# EAGLE design 100pqfpBreakout (EAGLE 6.6.0)
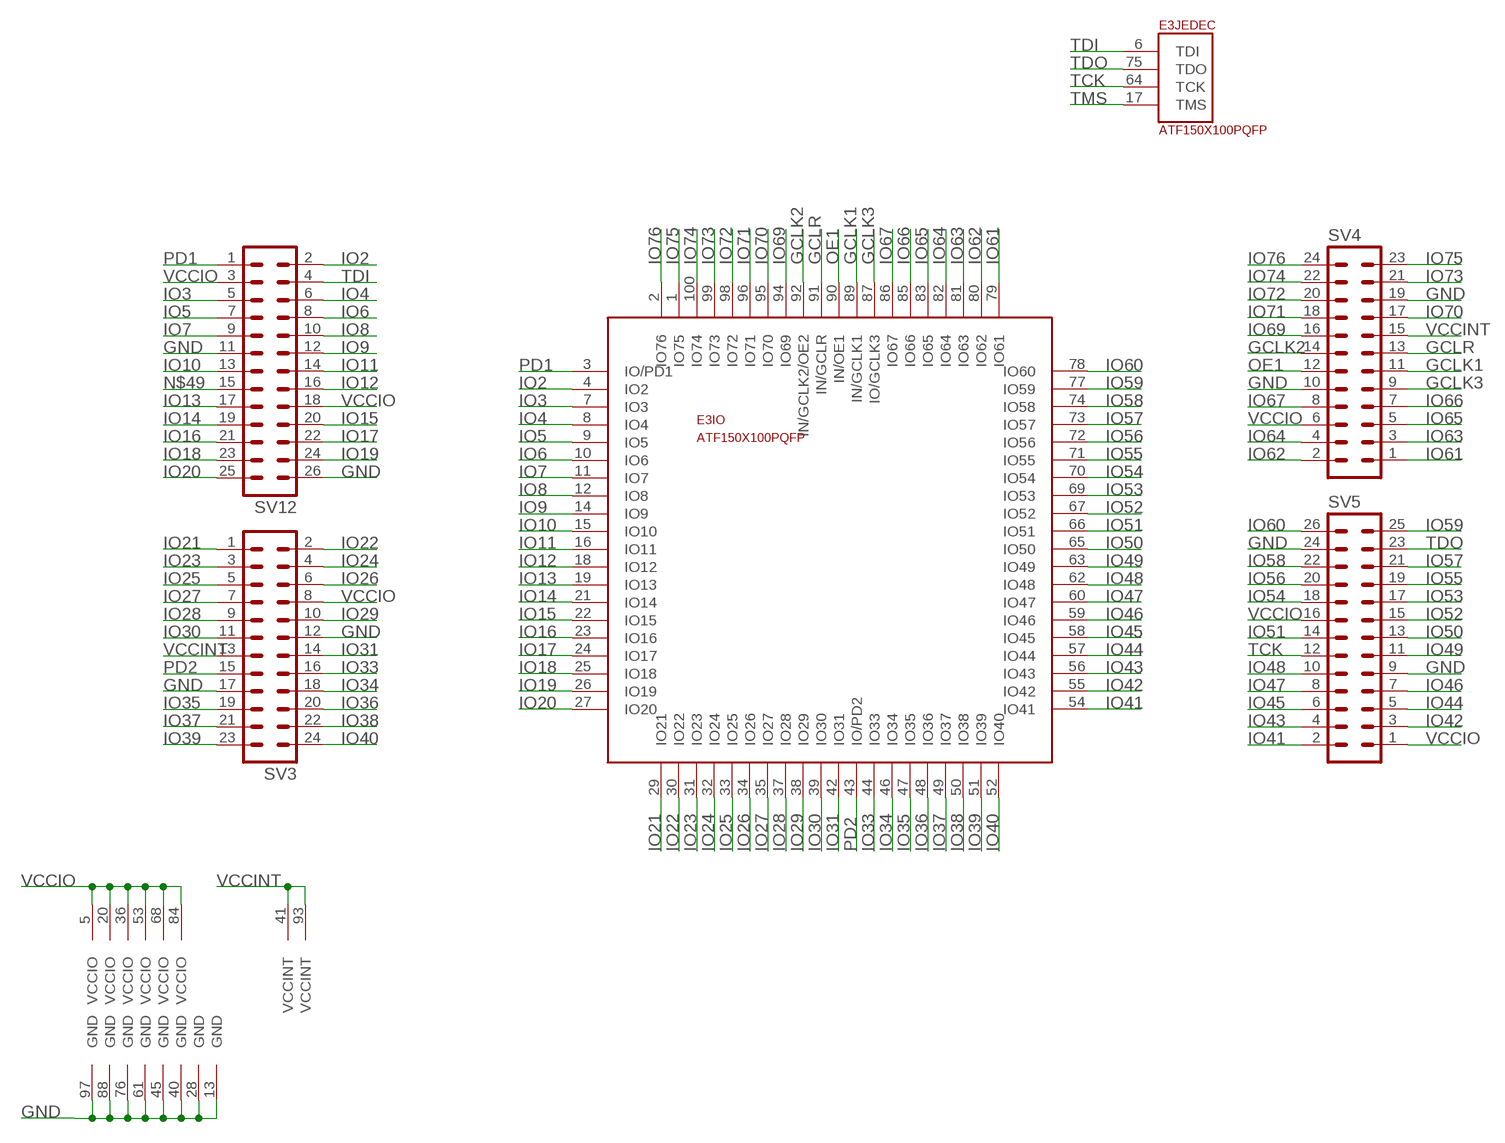
[diagram p0: schematic, sheet 1]

## Parts
E3  ATF150X100PQFP  [PQFP-100]
SV3  MA12-2  [MA12-2]
SV4  MA12-2  [MA12-2]
SV5  MA13-2  [MA13-2]
SV12  MA13-2  [MA13-2]

## Nets
GCLK1: E3.89(IO:IN/GCLK1) SV4.11
GCLK2: E3.92(IO:IN/GCLK2/OE2) SV4.14
GCLK3: E3.87(IO:IO/GCLK3) SV4.9
GCLR: E3.91(IO:IN/GCLR) SV4.13
GND: E3.13(GND) E3.28(GND) E3.40(GND) E3.45(GND) E3.61(GND) E3.76(GND) E3.88(GND) E3.97(GND) SV3.12 SV3.17 SV4.10 SV4.19 SV5.9 SV5.24 SV12.11 SV12.26
IO2: E3.4(IO:IO2) SV12.2
IO3: E3.7(IO:IO3) SV12.5
IO4: E3.8(IO:IO4) SV12.6
IO5: E3.9(IO:IO5) SV12.7
IO6: E3.10(IO:IO6) SV12.8
IO7: E3.11(IO:IO7) SV12.9
IO8: E3.12(IO:IO8) SV12.10
IO9: E3.14(IO:IO9) SV12.12
IO10: E3.15(IO:IO10) SV12.13
IO11: E3.16(IO:IO11) SV12.14
IO12: E3.18(IO:IO12) SV12.16
IO13: E3.19(IO:IO13) SV12.17
IO14: E3.21(IO:IO14) SV12.19
IO15: E3.22(IO:IO15) SV12.20
IO16: E3.23(IO:IO16) SV12.21
IO17: E3.24(IO:IO17) SV12.22
IO18: E3.25(IO:IO18) SV12.23
IO19: E3.26(IO:IO19) SV12.24
IO20: E3.27(IO:IO20) SV12.25
IO21: E3.29(IO:IO21) SV3.1
IO22: E3.30(IO:IO22) SV3.2
IO23: E3.31(IO:IO23) SV3.3
IO24: E3.32(IO:IO24) SV3.4
IO25: E3.33(IO:IO25) SV3.5
IO26: E3.34(IO:IO26) SV3.6
IO27: E3.35(IO:IO27) SV3.7
IO28: E3.37(IO:IO28) SV3.9
IO29: E3.38(IO:IO29) SV3.10
IO30: E3.39(IO:IO30) SV3.11
IO31: E3.42(IO:IO31) SV3.14
IO33: E3.44(IO:IO33) SV3.16
IO34: E3.46(IO:IO34) SV3.18
IO35: E3.47(IO:IO35) SV3.19
IO36: E3.48(IO:IO36) SV3.20
IO37: E3.49(IO:IO37) SV3.21
IO38: E3.50(IO:IO38) SV3.22
IO39: E3.51(IO:IO39) SV3.23
IO40: E3.52(IO:IO40) SV3.24
IO41: E3.54(IO:IO41) SV5.2
IO42: E3.55(IO:IO42) SV5.3
IO43: E3.56(IO:IO43) SV5.4
IO44: E3.57(IO:IO44) SV5.5
IO45: E3.58(IO:IO45) SV5.6
IO46: E3.59(IO:IO46) SV5.7
IO47: E3.60(IO:IO47) SV5.8
IO48: E3.62(IO:IO48) SV5.10
IO49: E3.63(IO:IO49) SV5.11
IO50: E3.65(IO:IO50) SV5.13
IO51: E3.66(IO:IO51) SV5.14
IO52: E3.67(IO:IO52) SV5.15
IO53: E3.69(IO:IO53) SV5.17
IO54: E3.70(IO:IO54) SV5.18
IO55: E3.71(IO:IO55) SV5.19
IO56: E3.72(IO:IO56) SV5.20
IO57: E3.73(IO:IO57) SV5.21
IO58: E3.74(IO:IO58) SV5.22
IO59: E3.77(IO:IO59) SV5.25
IO60: E3.78(IO:IO60) SV5.26
IO61: E3.79(IO:IO61) SV4.1
IO62: E3.80(IO:IO62) SV4.2
IO63: E3.81(IO:IO63) SV4.3
IO64: E3.82(IO:IO64) SV4.4
IO65: E3.83(IO:IO65) SV4.5
IO66: E3.85(IO:IO66) SV4.7
IO67: E3.86(IO:IO67) SV4.8
IO69: E3.94(IO:IO69) SV4.16
IO70: E3.95(IO:IO70) SV4.17
IO71: E3.96(IO:IO71) SV4.18
IO72: E3.98(IO:IO72) SV4.20
IO73: E3.99(IO:IO73) SV4.21
IO74: E3.100(IO:IO74) SV4.22
IO75: E3.1(IO:IO75) SV4.23
IO76: E3.2(IO:IO76) SV4.24
N$49: SV12.15
OE1: E3.90(IO:IN/OE1) SV4.12
PD1: E3.3(IO:IO/PD1) SV12.1
PD2: E3.43(IO:IO/PD2) SV3.15
TCK: E3.64(JEDEC:TCK) SV5.12
TDI: E3.6(JEDEC:TDI) SV12.4
TDO: E3.75(JEDEC:TDO) SV5.23
TMS: E3.17(JEDEC:TMS)
VCCINT: E3.41(VCCINT) E3.93(VCCINT) SV3.13 SV4.15
VCCIO: E3.5(VCCIO) E3.20(VCCIO) E3.36(VCCIO) E3.53(VCCIO) E3.68(VCCIO) E3.84(VCCIO) SV3.8 SV4.6 SV5.1 SV5.16 SV12.3 SV12.18

## Library data of the parts
E3 = atmel-cpld:ATF150X100: ATF150x in 100 pin package.
SV3 SV4 = con-lstb:MA12-2: PIN HEADER; OC_FARNELL: unknown; OC_NEWARK: unknown
SV5 SV12 = con-lstb:MA13-2: PIN HEADER; OC_FARNELL: unknown; OC_NEWARK: unknown

## Board
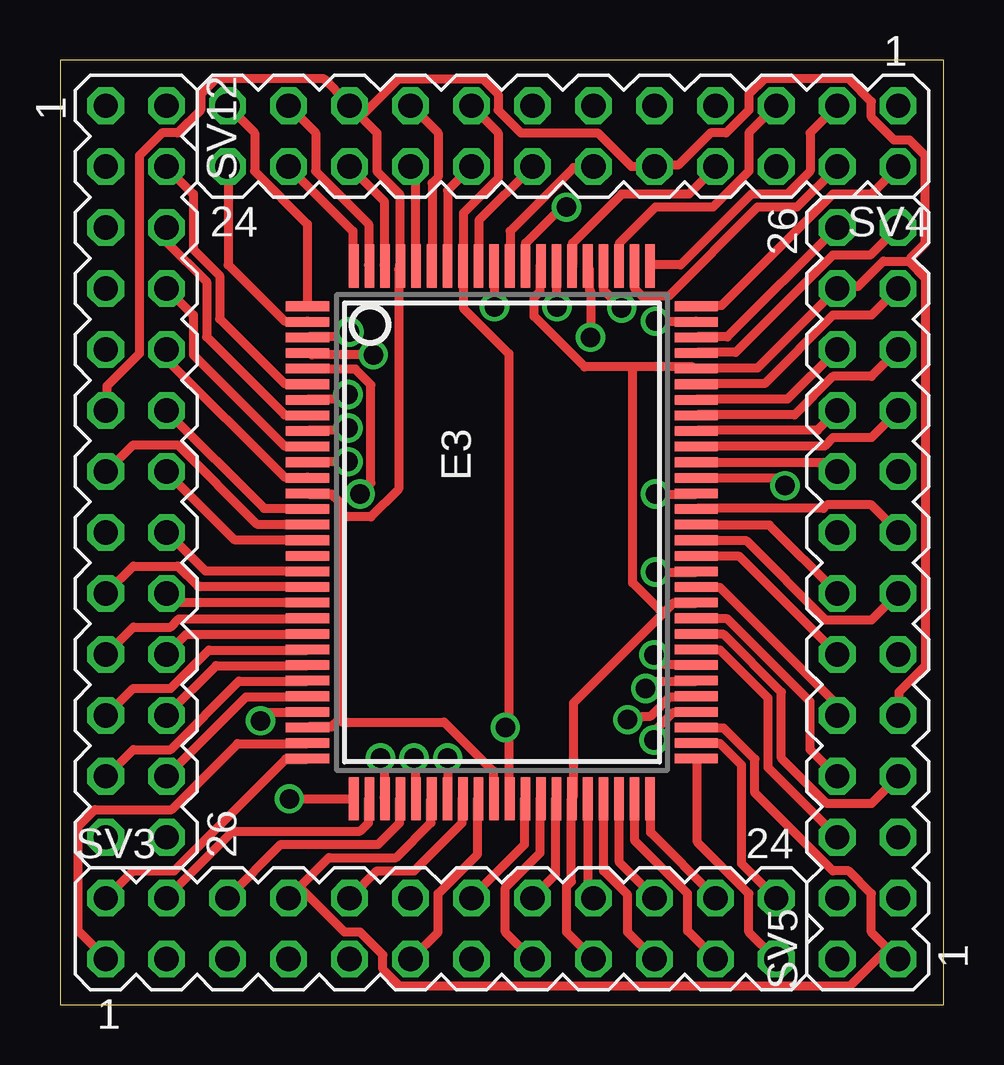
[diagram p1: board, top side]
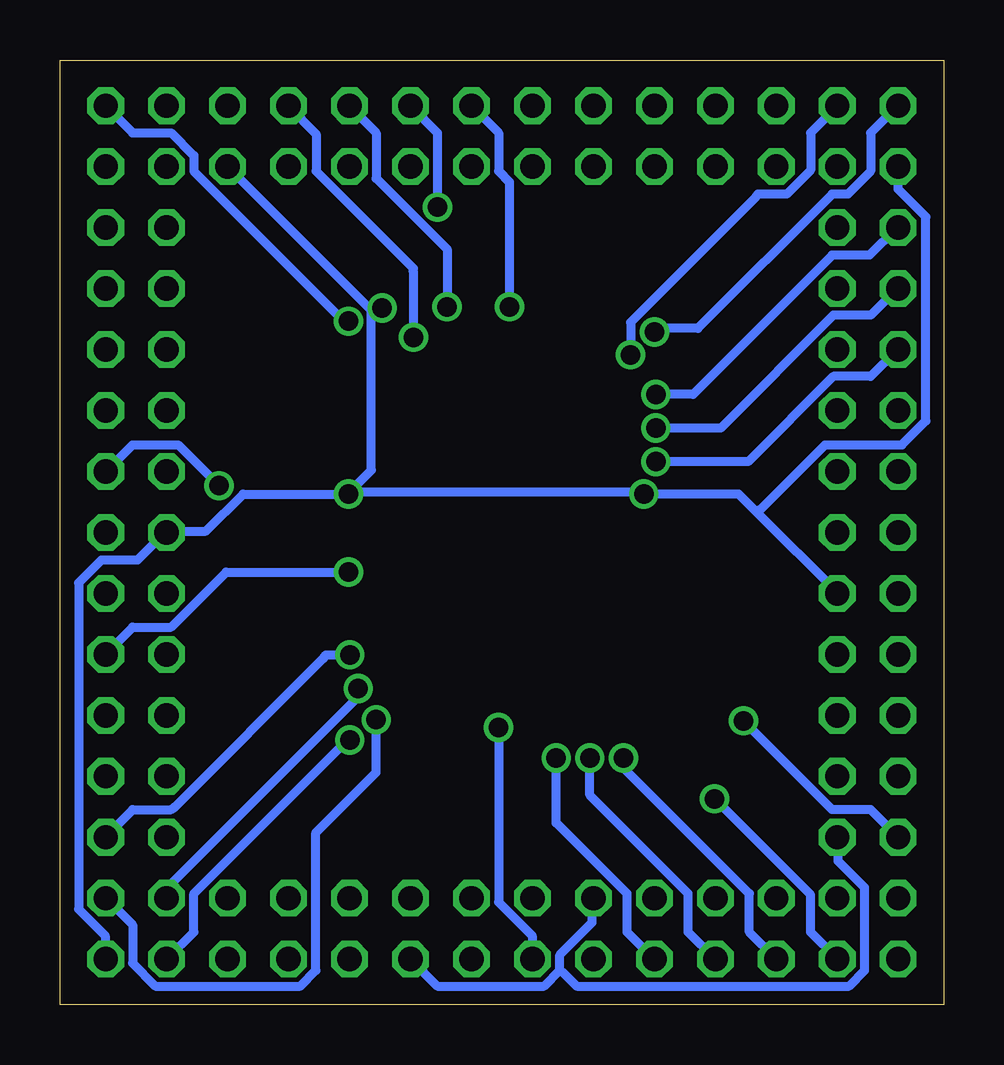
[diagram p2: board, bottom side, seen from below]

Size 36.83 x 39.37 mm. Coordinates in mm from the lower left corner, seen from the top.
Outline: 0,0 36.83,0 36.83,39.37 0,39.37 0,0
Copper layers (1*16): Top 0.035mm / dielectric 1.5mm / Bottom 0.035mm
Design rules "default *": minimum track width 15mil, minimum drill 32mil, track to track 6mil, track to pad 6mil, pad to pad 5mil, via to via 6mil, smd to smd 5mil, copper to edge 40mil, drill to drill 8mil, minimum pad ring 10mil, minimum via ring 8mil, stop-mask expansion 4mil, vias tented up to drill 32mil, thermal gap 10mil

### Footprints (pad centres in the part's own frame; a part is rotated, then mirrored left to right if it is on the bottom)
PQFP-100 = smd 0.4 x 1.8: 1 -9.425,-8.1; 2 -8.775,-8.1; 3 -8.125,-8.1; 4 -7.475,-8.1; 5 -6.825,-8.1; 6 -6.175,-8.1; 7 -5.525,-8.1; 8 -4.875,-8.1; 9 -4.225,-8.1; 10 -3.575,-8.1; 11 -2.925,-8.1; 12 -2.275,-8.1; 13 -1.625,-8.1; 14 -0.975,-8.1; 15 -0.325,-8.1; 16 0.325,-8.1; 17 0.975,-8.1; 18 1.625,-8.1; 19 2.275,-8.1; 20 2.925,-8.1; 21 3.575,-8.1; 22 4.225,-8.1; 23 4.875,-8.1; 24 5.525,-8.1; 25 6.175,-8.1; 26 6.825,-8.1; 27 7.475,-8.1; 28 8.125,-8.1; 29 8.775,-8.1; 30 9.425,-8.1; 51 9.425,8.1; 52 8.775,8.1; 53 8.125,8.1; 54 7.475,8.1; 55 6.825,8.1; 56 6.175,8.1; 57 5.525,8.1; 58 4.875,8.1; 59 4.225,8.1; 60 3.575,8.1; 61 2.925,8.1; 62 2.275,8.1; 63 1.625,8.1; 64 0.975,8.1; 65 0.325,8.1; 66 -0.325,8.1; 67 -0.975,8.1; 68 -1.625,8.1; 69 -2.275,8.1; 70 -2.925,8.1; 71 -3.575,8.1; 72 -4.225,8.1; 73 -4.875,8.1; 74 -5.525,8.1; 75 -6.175,8.1; 76 -6.825,8.1; 77 -7.475,8.1; 78 -8.125,8.1; 79 -8.775,8.1; 80 -9.425,8.1 | smd 1.8 x 0.4: 31 11.1,-6.175; 32 11.1,-5.525; 33 11.1,-4.875; 34 11.1,-4.225; 35 11.1,-3.575; 36 11.1,-2.925; 37 11.1,-2.275; 38 11.1,-1.625; 39 11.1,-0.975; 40 11.1,-0.325; 41 11.1,0.325; 42 11.1,0.975; 43 11.1,1.625; 44 11.1,2.275; 45 11.1,2.925; 46 11.1,3.575; 47 11.1,4.225; 48 11.1,4.875; 49 11.1,5.525; 50 11.1,6.175; 81 -11.1,6.175; 82 -11.1,5.525; 83 -11.1,4.875; 84 -11.1,4.225; 85 -11.1,3.575; 86 -11.1,2.925; 87 -11.1,2.275; 88 -11.1,1.625; 89 -11.1,0.975; 90 -11.1,0.325; 91 -11.1,-0.325; 92 -11.1,-0.975; 93 -11.1,-1.625; 94 -11.1,-2.275; 95 -11.1,-2.925; 96 -11.1,-3.575; 97 -11.1,-4.225; 98 -11.1,-4.875; 99 -11.1,-5.525; 100 -11.1,-6.175
MA12-2 = drill 1.016 octagon: 1 -13.97,-1.27; 2 -13.97,1.27; 3 -11.43,-1.27; 4 -11.43,1.27; 5 -8.89,-1.27; 6 -8.89,1.27; 7 -6.35,-1.27; 8 -6.35,1.27; 9 -3.81,-1.27; 10 -3.81,1.27; 11 -1.27,-1.27; 12 -1.27,1.27; 13 1.27,-1.27; 14 1.27,1.27; 15 3.81,-1.27; 16 3.81,1.27; 17 6.35,-1.27; 18 6.35,1.27; 19 8.89,-1.27; 20 8.89,1.27; 21 11.43,-1.27; 22 11.43,1.27; 23 13.97,-1.27; 24 13.97,1.27
MA13-2 = drill 1.016 octagon: 1 -15.24,-1.27; 2 -15.24,1.27; 3 -12.7,-1.27; 4 -12.7,1.27; 5 -10.16,-1.27; 6 -10.16,1.27; 7 -7.62,-1.27; 8 -7.62,1.27; 9 -5.08,-1.27; 10 -5.08,1.27; 11 -2.54,-1.27; 12 -2.54,1.27; 13 0,-1.27; 14 0,1.27; 15 2.54,-1.27; 16 2.54,1.27; 17 5.08,-1.27; 18 5.08,1.27; 19 7.62,-1.27; 20 7.62,1.27; 21 10.16,-1.27; 22 10.16,1.27; 23 12.7,-1.27; 24 12.7,1.27; 25 15.24,-1.27; 26 15.24,1.27

### Placement (x,y rotation side)
E3  18.41,19.68 270 top
SV3  15.88,3.17 0 top
SV4  20.95,36.2 180 top
SV5  33.66,17.14 90 top
SV12  3.17,22.23 270 top

### Tracks (layer width: path | path; a pad name or v marks a point on that pad's centre or on a via)
GCLK1  (via drill 0.81)
  Top 0.381: v21.11,33.23 20.91,33.23 19.41,31.73 19.41,30.84 E3.89
  Bottom 0.381: v21.11,33.23 21.11,36.34 22.2,37.44 SV4.11
GCLK2
  Top 0.381: E3.92 17.45,30.84 17.45,32.69 19.66,34.88 SV4.14
GCLK3  (via drill 0.81)
  Top 0.381: v20.7,29.09 20.7,30.79 E3.87
  Bottom 0.381: v20.7,29.09 20.7,31.48 23.66,34.44 23.66,36.34 24.75,37.44 SV4.9
GCLR  (via drill 0.81)
  Top 0.381: v18.11,29.09 18.11,30.79 E3.91
  Bottom 0.381: v18.11,29.09 18.11,34.28 18.55,34.73 18.55,36.34 19.66,37.44 SV4.13
GND
  Top 0.381: 11.61,11.88 11.3,11.59 10.36,11.59 E3.28 | 11.61,20.34 11.61,20.98 11.3,21.29 10.36,21.29 E3.13 | 11.61,20.34 11.61,11.88 | SV4.19 12.11,37.44 13.21,36.34 13.21,34.73 14.15,33.78 14.15,30.84 E3.97 14.11,30.64 14.11,21.48 12.96,20.34 11.76,20.34 11.61,20.34 | SV12.11 1.96,24.79 1.96,25.79 3.31,27.14 3.31,35.38 4.25,36.34 4.91,36.34 5.86,37.28 5.86,37.94 6.5,38.59 11.01,38.59 11.96,37.63 SV4.19 | SV4.19 12.65,37.13 14.11,38.59 17.61,38.59 18.25,37.94 18.25,37.28 19.2,36.34 22.41,36.34 23.8,34.94 24.75,34.94 SV4.10 24.95,34.98 25.75,34.98 27.11,36.34 27.75,36.34 28.7,37.28 28.7,37.94 29.36,38.59 32.85,38.59 33.8,37.63 33.8,36.98 34.76,36.03 35.41,36.03 36.05,35.38 36.05,31.73 35.45,31.14 35.35,30.98 | 23.86,26.59 26.36,26.59 E3.76 26.55,26.54 29.05,26.54 32.35,29.84 SV5.24 32.55,29.93 33.26,29.93 34.3,30.98 35.35,30.98 | 23.86,26.59 21.86,26.59 19.75,28.68 19.75,29.48 20,29.73 20,30.79 E3.88 | 35.35,30.98 36.05,30.29 36.05,14.13 34.95,13.04 34.95,12.09 SV5.9 | SV3.17 22.2,1.94 21.11,3.04 21.11,4.93 21.3,5.13 21.3,8.59 E3.45 21.41,8.73 21.41,12.59 25.13,16.31 | 25.13,16.31 25.55,16.73 26.5,16.73 E3.61 | 23.86,26.59 23.86,26.43 23.86,17.59 25,16.43 25.13,16.31 | E3.40 18.05,8.63 18.05,9.73 16,11.79 11.76,11.79 11.61,11.88
  Bottom 0.381: 16,1.44 16,2.08 14.65,3.44 14.65,4.43 SV3.12 | 16,1.44 16.66,0.79 21.11,0.79 22.2,1.89 SV3.17 | SV12.26 4.41,6.99 4.41,5.99 3.31,4.88 3.31,1.44 3.96,0.79 15.3,0.79 15.86,1.33 16,1.44
IO2  (via drill 0.81)
  Top 0.381: 10.36,27.18 E3.4 10.51,27.09 v13.05,27.09
  Bottom 0.381: SV12.2 4.46,37.44 5.55,36.34 5.55,34.78 6.55,33.78 7.75,33.78 7.86,33.63 13.05,28.43 v13.05,27.09
IO3  (via drill 0.81)
  Top 0.381: v12.01,25.43 11.8,25.23 10.36,25.23 E3.7
  Bottom 0.381: v12.01,25.43 10.46,25.43 4.66,31.23 3.1,31.23 1.96,32.38 SV12.5
IO4
  Top 0.381: E3.8 10.3,24.59 9.36,24.59 6.11,27.84 6.11,30.14 4.46,31.79 SV12.6
IO5  (via drill 0.81)
  Top 0.381: v12.01,24.04 11.9,23.93 10.36,23.93 E3.9
  Bottom 0.381: v12.01,24.04 9.3,24.04 4.61,28.73 3.06,28.73 1.96,29.84 SV12.7
IO6
  Top 0.381: E3.10 10.3,23.29 9.36,23.29 5.55,27.09 5.55,28.73 4.46,29.84 SV12.8
IO7  (via drill 0.81)
  Top 0.381: v12.01,22.64 10.36,22.64 E3.11
  Bottom 0.381: v12.01,22.64 8.15,22.64 4.61,26.18 3.06,26.18 1.96,27.29 SV12.9
IO8
  Top 0.381: E3.12 10.3,21.98 9.36,21.98 4.46,26.89 4.46,27.29 SV12.10
IO9
  Top 0.381: E3.14 10.3,20.68 8.51,20.68 4.46,24.73 SV12.12
IO10
  Top 0.381: E3.15 10.3,20.04 8.21,20.04 4.91,23.34 3.06,23.34 1.96,22.23 SV12.13
IO11
  Top 0.381: E3.16 10.3,19.39 7.25,19.39 4.46,22.18 SV12.14
IO12
  Top 0.381: E3.18 10.3,18.09 6.05,18.09 SV12.16
IO13
  Top 0.381: E3.19 10.3,17.43 5.75,17.43 4.91,18.29 3.06,18.29 1.96,17.18 SV12.17
IO14
  Top 0.381: E3.21 10.3,16.09 4.96,16.09 4.61,15.73 3.06,15.73 1.96,14.63 SV12.19
IO15
  Top 0.381: E3.22 10.3,15.44 5.25,15.44 4.46,14.63 SV12.20
IO16
  Top 0.381: E3.23 10.3,14.79 6.21,14.79 4.61,13.19 3.06,13.19 1.96,12.09 SV12.21
IO17
  Top 0.381: E3.24 10.3,14.13 6.5,14.13 4.46,12.09 SV12.22
IO18
  Top 0.381: E3.25 10.3,13.48 7.46,13.48 4.61,10.63 3.06,10.63 1.96,9.54 SV12.23
IO19
  Top 0.381: E3.26 10.3,12.84 7.75,12.84 SV12.24
IO20  (via drill 0.81)
  Top 0.381: v8.36,11.84 8.71,12.19 10.3,12.19 E3.27
  Bottom 0.381: v8.36,11.84 4.66,8.13 3.06,8.13 1.96,7.04 SV12.25
IO21
  Top 0.381: E3.29 10.3,10.88 7.41,10.88 4.66,8.13 1.46,8.13 0.76,7.43 0.76,3.08 1.91,1.94 SV3.1
IO22
  Top 0.381: E3.30 10.3,10.23 9.4,10.23 4.75,5.58 3.06,5.58 1.96,4.49 SV3.2
IO23  (via drill 0.81)
  Top 0.381: v9.55,8.59 12.21,8.59 E3.31
  Bottom 0.381: v9.55,8.59 5.55,4.58 5.55,3.04 4.46,1.94 SV3.3
IO24
  Top 0.381: E3.32 12.86,8.59 12.86,7.58 12.51,7.24 7.21,7.24 4.46,4.49 SV3.4
IO25  (via drill 0.81)
  Top 0.381: v13.36,10.29 13.51,10.13 13.51,8.63 E3.33
  Bottom 0.381: v13.36,10.29 13.36,9.88 8.11,4.63 8.11,3.04 7,1.94 SV3.5
IO26
  Top 0.381: E3.34 14.15,8.59 14.15,7.58 13.26,6.68 9.21,6.68 7,4.49 SV3.6
IO27  (via drill 0.81)
  Top 0.381: v14.76,10.29 14.8,10.23 14.8,8.63 E3.35
  Bottom 0.381: v14.76,10.29 14.76,8.73 10.65,4.63 10.65,3.04 9.55,1.94 SV3.7
IO28  (via drill 0.81)
  Top 0.381: v16.16,10.29 16.16,8.63 E3.37
  Bottom 0.381: v16.16,10.29 16.16,7.58 13.21,4.63 13.21,3.04 12.11,1.94 SV3.9
IO29
  Top 0.381: E3.38 16.75,8.59 16.75,7.58 14.76,5.58 13.21,5.58 12.11,4.49 SV3.10
IO30
  Top 0.381: E3.39 17.41,8.59 17.41,6.29 15.76,4.63 15.76,3.04 14.65,1.94 SV3.11
IO31
  Top 0.381: E3.42 19.36,8.59 19.36,6.68 17.16,4.49 SV3.14
IO33
  Top 0.381: E3.44 20.66,8.59 20.66,5.43 19.7,4.49 SV3.16
IO34
  Top 0.381: E3.46 22,8.59 22,4.68 22.2,4.49 SV3.18
IO35
  Top 0.381: E3.47 22.66,8.59 22.66,5.58 23.66,4.58 23.66,3.04 24.75,1.94 SV3.19
IO36
  Top 0.381: E3.48 23.3,8.59 23.3,5.93 24.75,4.49 SV3.20
IO37
  Top 0.381: E3.49 23.95,8.59 23.95,6.83 26.16,4.63 26.16,3.08 27.3,1.94 SV3.21
IO38
  Top 0.381: E3.50 24.61,8.59 24.61,7.18 27.3,4.49 SV3.22
IO39
  Top 0.381: E3.51 26.55,10.23 26.55,6.79 28.7,4.63 28.7,3.04 29.8,1.94 SV3.23
IO40
  Top 0.381: E3.52 26.55,10.88 27.5,10.88 28.41,9.98 28.41,5.88 29.8,4.49 SV3.24
IO41  (via drill 0.81)
  Top 0.381: E3.54 26.5,12.19 25.55,12.19 24.8,11.44 24.8,11.09 v24.75,11.04
  Bottom 0.381: SV5.2 32.35,1.94 31.25,3.04 31.25,4.63 24.8,11.09 v24.75,11.04
IO42  (via drill 0.81)
  Top 0.381: v23.66,11.88 23.8,12.04 24.61,12.04 25.41,12.84 26.5,12.84 E3.55
  Bottom 0.381: v23.66,11.88 23.66,9.69 26.16,7.17 26.16,1.44 26.82,0.79 32.85,0.79 33.8,1.74 33.8,3.33 34.91,4.43 SV5.3
IO43  (via drill 0.81)
  Top 0.381: v24.41,13.19 24.7,13.48 26.5,13.48 E3.56
  Bottom 0.381: v24.41,13.19 24.41,12.84 32.35,4.88 32.35,4.49 SV5.4
IO44  (via drill 0.81)
  Top 0.381: E3.57 26.5,14.19 25.2,14.19 24.8,14.59 v24.75,14.59
  Bottom 0.381: SV5.5 34.91,7.04 33.8,8.13 32.2,8.13 32.05,8.23 25.86,14.44 25.75,14.59 24.8,14.59 v24.75,14.59
IO45
  Top 0.381: E3.58 26.55,14.79 27.5,14.79 29.5,12.79 29.5,9.88 32.35,7.04 SV5.6
IO46
  Top 0.381: E3.59 26.55,15.44 27.66,15.44 30.05,13.04 30.05,10.29 31.95,8.38 33.8,8.38 34.91,9.48 SV5.7
IO47
  Top 0.381: E3.60 26.55,16.09 27.8,16.09 31.25,12.63 31.25,10.63 32.35,9.54 SV5.8
IO48
  Top 0.381: E3.62 26.55,17.39 27.5,17.39 32.35,12.54 32.35,12.09 SV5.10
IO49  (via drill 0.81)
  Top 0.381: v24.8,18.04 26.5,18.04 E3.63
  Bottom 0.381: v24.8,18.04 29.91,18.04 32.2,15.73 33.8,15.73 34.91,14.63 SV5.11
IO50
  Top 0.381: E3.65 26.55,19.34 28.61,19.34 31.91,16.04 33.8,16.04 34.91,17.14 SV5.13
IO51
  Top 0.381: E3.66 26.55,19.98 29.55,19.98 32.35,17.18 SV5.14
IO52
  Top 0.381: E3.67 26.55,20.68 31.8,20.68 31.95,20.84 33.8,20.84 34.91,19.73 SV5.15
IO53  (via drill 0.81)
  Top 0.381: v30.2,21.64 29.91,21.93 26.55,21.93 E3.69
  Bottom 0.381: v30.2,21.64 31.91,23.34 33.8,23.34 34.91,22.23 SV5.17
IO54
  Top 0.381: E3.70 26.55,22.59 32.01,22.59 32.35,22.23 SV5.18
IO55
  Top 0.381: E3.71 26.55,23.29 31.86,23.29 32.2,23.64 33.8,23.64 34.91,24.73 SV5.19
IO56
  Top 0.381: E3.72 26.55,23.93 31.55,23.93 32.35,24.73 SV5.20
IO57
  Top 0.381: E3.73 26.55,24.59 30.61,24.59 32.2,26.18 33.8,26.18 34.91,27.29 SV5.21
IO58
  Top 0.381: E3.74 26.55,25.23 30.3,25.23 32.35,27.29 SV5.22
IO59
  Top 0.381: E3.77 26.55,27.18 28.16,27.18 32.2,31.23 33.76,31.23 34.91,32.38 SV5.25
IO60
  Top 0.381: E3.78 26.55,27.84 27.8,27.84 32.35,32.38 SV5.26
IO61  (via drill 0.81)
  Top 0.381: v24.8,28.48 26.5,28.48 E3.79
  Bottom 0.381: v24.8,28.48 25,28.48 31.25,34.73 31.25,35.38 32.2,36.34 33.8,36.34 34.91,37.44 SV4.1
IO62
  Top 0.381: E3.80 26.55,29.14 27.55,29.14 32.2,33.78 33.8,33.78 34.91,34.88 SV4.2
IO63
  Top 0.381: E3.81 24.61,30.84 25.86,30.84 28.8,33.78 30.3,33.78 31.25,34.73 31.25,36.34 32.35,37.44 SV4.3
IO64
  Top 0.381: E3.82 23.95,30.79 23.95,29.84 24.25,29.54 25.36,29.54 29.05,33.23 30.7,33.23 32.35,34.88 SV4.4
IO65
  Top 0.381: E3.83 23.3,30.84 23.3,31.73 24.8,33.23 27.2,33.23 28.7,34.73 28.7,36.34 29.8,37.44 SV4.5
IO66  (via drill 0.81)
  Top 0.381: 22,30.79 E3.85 22.05,30.64 22.05,29.79 22.11,29.73 22.11,27.84 v22.11,27.82
  Bottom 0.381: SV4.7 27.3,37.44 26.16,36.28 26.16,34.73 22.11,30.68 22.11,30.54 22.11,27.84 v22.11,27.82
IO67
  Top 0.381: E3.86 21.36,30.84 21.36,31.73 23.41,33.78 26.2,33.78 27.3,34.88 SV4.8
IO69
  Top 0.381: E3.94 16.16,30.84 16.16,33.94 17.11,34.88 SV4.16
IO70
  Top 0.381: E3.95 15.51,30.84 15.51,34.23 15.76,34.48 15.76,36.34 14.65,37.44 SV4.17
IO71
  Top 0.381: E3.96 14.8,30.84 14.8,34.73 14.65,34.88 SV4.18
IO72
  Top 0.381: E3.98 13.51,30.84 13.51,33.48 12.11,34.88 SV4.20
IO73
  Top 0.381: E3.99 12.86,30.84 12.86,32.53 10.65,34.73 10.65,36.34 9.55,37.44 SV4.21
IO74
  Top 0.381: E3.100 12.21,30.84 12.21,32.23 9.55,34.88 SV4.22
IO75
  Top 0.381: E3.1 10.3,29.14 10.3,32.53 8.11,34.73 8.11,36.34 7,37.44 SV4.23
IO76
  Top 0.381: E3.2 10.3,28.48 9.36,28.48 7,30.84 7,34.88 SV4.24
OE1
  Top 0.381: E3.90 18.75,30.84 18.75,32.23 21.41,34.88 22.2,34.88 SV4.12
PD1  (via drill 0.81)
  Top 0.381: 12.01,28.18 11.96,28.14 | 11.96,28.14 11.65,27.84 10.36,27.84 E3.3 | v12.05,28.04 11.96,28.14
  Bottom 0.381: SV12.1 1.96,37.44 3.06,36.34 3.06,34.73 4,33.78 4.66,33.78 10.26,28.18 12.01,28.18 v12.05,28.04
PD2
  Top 0.381: E3.43 20,8.59 20,6.33 18.55,4.88 18.55,3.04 19.66,1.94 SV3.15
TCK
  Top 0.381: E3.64 26.55,18.68 28.3,18.68 32.35,14.63 SV5.12
TDI
  Top 0.381: E3.6 10.3,25.89 9.36,25.89 6.66,28.59 6.66,30.39 5.55,31.48 5.55,33.78 4.46,34.88 SV12.4
TDO
  Top 0.381: E3.75 26.55,25.89 29.36,25.89 32.2,28.73 33.8,28.73 34.91,29.84 SV5.23
VCCINT  (via drill 0.81)
  Top 0.381: SV4.15 17.16,37.44 18.25,36.34 18.25,34.44 16.8,32.98 16.8,30.84 E3.93 16.8,30.59 16.8,29.04 18.7,27.14 18.7,11.55 | 18.7,11.55 18.7,8.63 E3.41 | v18.55,11.55 18.7,11.55
  Bottom 0.381: v18.55,11.55 18.55,4.29 17.16,2.88 17.16,1.94 SV3.13
VCCIO  (via drill 0.81)
  Top 0.381: E3.20 10.3,16.79 4.8,16.79 4.46,17.14 SV12.18 | v12.51,21.29 12.96,21.73 12.96,25.84 12.3,26.48 10.36,26.48 E3.5 | v24.8,21.29 26.5,21.29 E3.68 | E3.36 15.46,8.59 15.46,7.58 14.01,6.13 11.21,6.13 9.55,4.49 SV3.8 10.11,4.79 11.86,3.04 12.51,3.04 13.46,2.08 13.46,1.49 14.15,0.79 32.91,0.79 34.35,2.23 SV5.1 34.91,1.94 33.8,3.04 33.8,4.63 32.85,5.58 32.2,5.58 28.95,8.84 28.95,10.23 27.66,11.54 26.55,11.54 E3.53 | v23.41,29.04 22.66,29.79 22.66,30.79 E3.84
  Bottom 0.381: 7.78,20.51 4.46,17.18 SV12.18 | 7.78,20.51 8.55,21.29 v12.51,21.29 12.65,21.39 24.5,21.39 v24.8,21.29 | SV12.3 1.91,34.88 1.91,33.98 0.76,32.84 0.76,24.34 1.75,23.34 4.96,23.34 7.66,20.64 7.78,20.51 | v24.8,21.29 29.2,21.29 30.75,19.73 32.35,19.73 SV5.16 32.55,19.59 33.6,18.54 35.1,18.54 36.05,17.59 36.05,3.98 34.95,2.88 34.95,1.94 SV5.1 | 23.86,28.93 29.8,34.88 SV4.6 | 23.86,28.93 23.86,22.29 24.7,21.43 v24.8,21.29 | v23.41,29.04 23.7,29.04 23.86,28.93